# Altium schematic sheet DAU-3Phase-Measuring.SchDoc
size A3
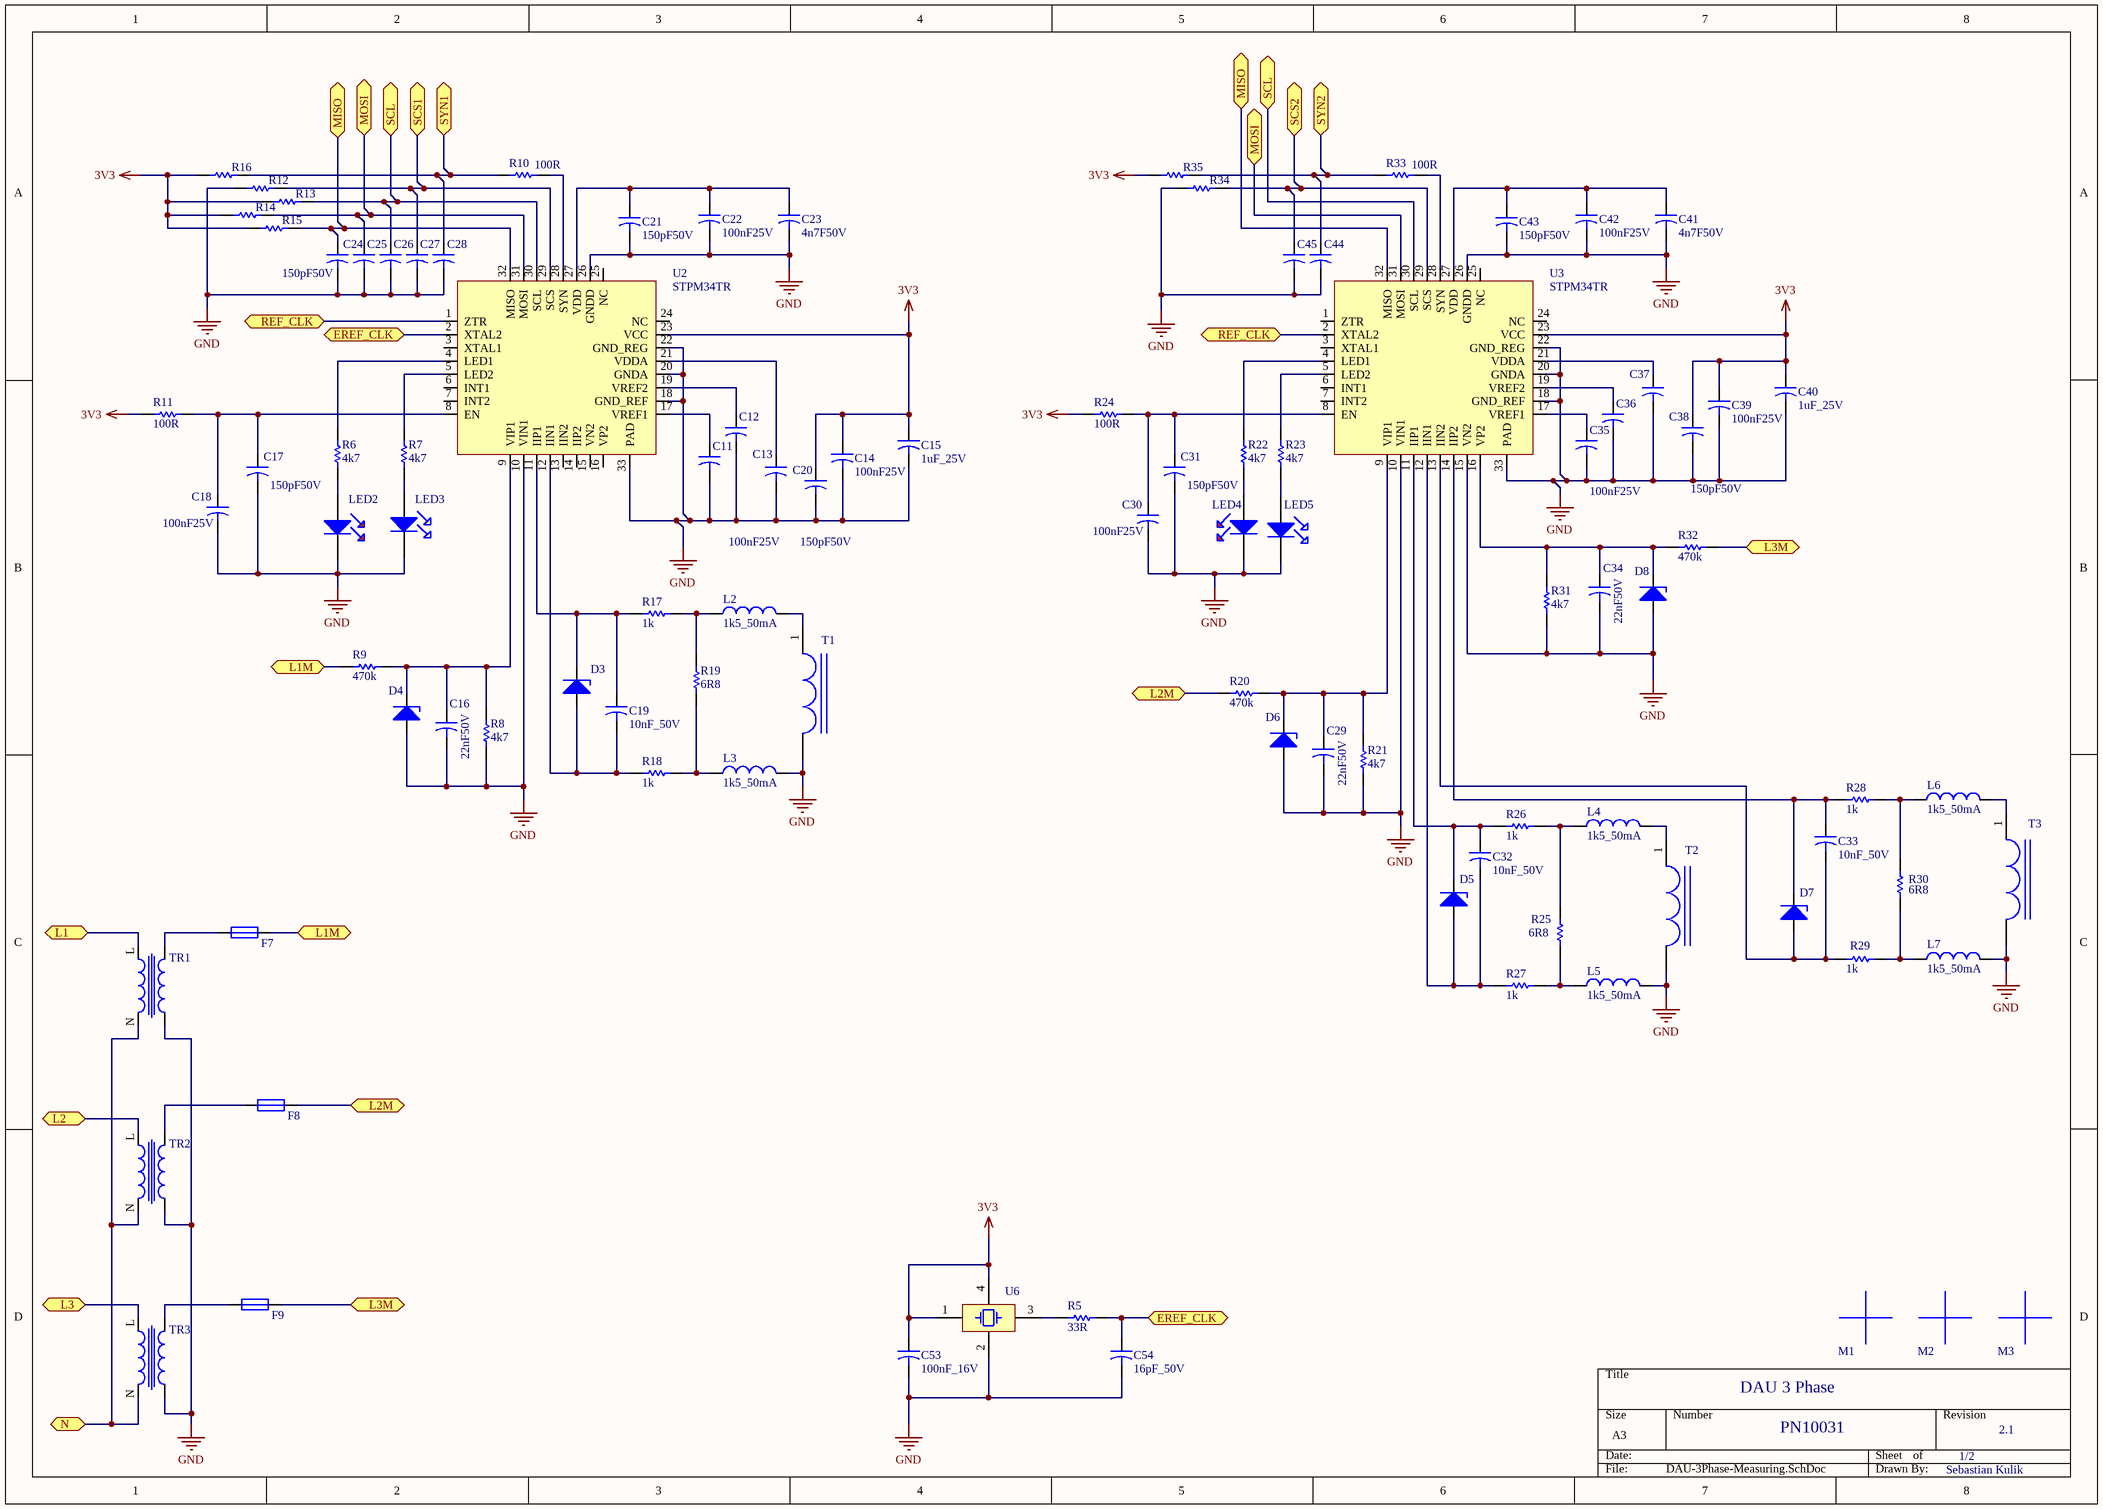
[diagram p0: DAU-3Phase-Measuring.SchDoc]

## Parts
C11  value 100nF25V  [C0402]  (hidden comment: 100nF25V_0402)
C12  100nF25V_0402  [C0402]  (value not drawn)
C13  100nF25V_0402  [C0402]  (value not drawn)
C14  value 100nF25V  [C0402]  (hidden comment: 100nF25V_0402)
C15  value 1uF_25V  [C0603]  (hidden comment: 1uF25V_0603)
C16  value 22nF50V  [C0603]  (hidden comment: 22nF50V_0603)
C17  value 150pF50V  [C0402]  (hidden comment: 150p50V_0402)
C18  value 100nF25V  [C0402]  (hidden comment: 100nF25V_0402)
C19  value 10nF_50V  [C0603]  (hidden comment: 10nF50V_0603)
C20  value 150pF50V  [C0402]  (hidden comment: 150p50V_0402)
C21  value 150pF50V  [C0402]  (hidden comment: 150p50V_0402)
C22  value 100nF25V  [C0402]  (hidden comment: 100nF25V_0402)
C23  value 4n7F50V  [C0402]  (hidden comment: 4n7F50V_0402)
C24  value 150pF50V  [C0402]  (hidden comment: 150p50V_0402)
C25  150p50V_0402  [C0402]  (value not drawn)
C26  150p50V_0402  [C0402]  (value not drawn)
C27  150p50V_0402  [C0402]  (value not drawn)
C28  150p50V_0402  [C0402]  (value not drawn)
C29  value 22nF50V  [C0603]  (hidden comment: 22nF50V_0603)
C30  value 100nF25V  [C0402]  (hidden comment: 100nF25V_0402)
C31  value 150pF50V  [C0402]  (hidden comment: 150p50V_0402)
C32  value 10nF_50V  [C0603]  (hidden comment: 10nF50V_0603)
C33  value 10nF_50V  [C0603]  (hidden comment: 10nF50V_0603)
C34  value 22nF50V  [C0603]  (hidden comment: 22nF50V_0603)
C35  value 100nF25V  [C0402]  (hidden comment: 100nF25V_0402)
C36  100nF25V_0402  [C0402]  (value not drawn)
C37  100nF25V_0402  [C0402]  (value not drawn)
C38  value 150pF50V  [C0402]  (hidden comment: 150p50V_0402)
C39  value 100nF25V  [C0402]  (hidden comment: 100nF25V_0402)
C40  value 1uF_25V  [C0603]  (hidden comment: 1uF25V_0603)
C41  value 4n7F50V  [C0402]  (hidden comment: 4n7F50V_0402)
C42  value 100nF25V  [C0402]  (hidden comment: 100nF25V_0402)
C43  value 150pF50V  [C0402]  (hidden comment: 150p50V_0402)
C44  150p50V_0402  [C0402]  (value not drawn)
C45  150p50V_0402  [C0402]  (value not drawn)
C53  value 100nF_16V  [C0402]  (hidden comment: 100nF16V_0402)
C54  value 16pF_50V  [C0402]  (hidden comment: 16pF50V_0402)
D3  MMSZ4678T1G  [SOD123]  (value not drawn)
D4  MMSZ4678T1G  [SOD123]  (value not drawn)
D5  MMSZ4678T1G  [SOD123]  (value not drawn)
D6  MMSZ4678T1G  [SOD123]  (value not drawn)
D7  MMSZ4678T1G  [SOD123]  (value not drawn)
D8  MMSZ4678T1G  [SOD123]  (value not drawn)
F7  MCMET 250MA 250V  [TR5]  (value not drawn)
F8  MCMET 250MA 250V  [TR5]  (value not drawn)
F9  MCMET 250MA 250V  [TR5]  (value not drawn)
L2  value 1k5_50mA  [L0603]  (hidden comment: 1k5_50mA_0603)
L3  value 1k5_50mA  [L0603]  (hidden comment: 1k5_50mA_0603)
L4  value 1k5_50mA  [L0603]  (hidden comment: 1k5_50mA_0603)
L5  value 1k5_50mA  [L0603]  (hidden comment: 1k5_50mA_0603)
L6  value 1k5_50mA  [L0603]  (hidden comment: 1k5_50mA_0603)
L7  value 1k5_50mA  [L0603]  (hidden comment: 1k5_50mA_0603)
LED2  WL-SMCW-RED  [WE-0603]  (value not drawn)
LED3  WL-SMCW-YELLOW  [WE-0603]  (value not drawn)
LED4  WL-SMCW-RED  [WE-0603]  (value not drawn)
LED5  WL-SMCW-YELLOW  [WE-0603]  (value not drawn)
M1  Paste Mark  [Mark-3mm]  (value not drawn)
M2  Paste Mark  [Mark-3mm]  (value not drawn)
M3  Paste Mark  [Mark-3mm]  (value not drawn)
R5  value 33R  [R0402]  (hidden comment: 33R_0402)
R6  value 4k7  [R0402]  (hidden comment: 4k7_0402)
R7  value 4k7  [R0402]  (hidden comment: 4k7_0402)
R8  value 4k7  [R0204-MELF4]  (hidden comment: 4k7_0204_MELF)
R9  value 470k  [R0204-MELF4]  (hidden comment: 470k_0204_MELF)
R10  value 100R  [R0402]  (hidden comment: 100R_0402)
R11  value 100R  [R0402]  (hidden comment: 100R_0402)
R12  10k_0402  [R0402]  (value not drawn)
R13  10k_0402  [R0402]  (value not drawn)
R14  10k_0402  [R0402]  (value not drawn)
R15  10k_0402  [R0402]  (value not drawn)
R16  10k_0402  [R0402]  (value not drawn)
R17  value 1k  [R0603(1608)]  (hidden comment: 1k_0603)
R18  value 1k  [R0603(1608)]  (hidden comment: 1k_0603)
R19  value 6R8  [R0204-MELF4]  (hidden comment: 6R8_0204_MELF)
R20  value 470k  [R0204-MELF4]  (hidden comment: 470k_0204_MELF)
R21  value 4k7  [R0204-MELF4]  (hidden comment: 4k7_0204_MELF)
R22  value 4k7  [R0402]  (hidden comment: 4k7_0402)
R23  value 4k7  [R0402]  (hidden comment: 4k7_0402)
R24  value 100R  [R0402]  (hidden comment: 100R_0402)
R25  value 6R8  [R0204-MELF4]  (hidden comment: 6R8_0204_MELF)
R26  value 1k  [R0603(1608)]  (hidden comment: 1k_0603)
R27  value 1k  [R0603(1608)]  (hidden comment: 1k_0603)
R28  value 1k  [R0603(1608)]  (hidden comment: 1k_0603)
R29  value 1k  [R0603(1608)]  (hidden comment: 1k_0603)
R30  value 6R8  [R0204-MELF4]  (hidden comment: 6R8_0204_MELF)
R31  value 4k7  [R0204-MELF4]  (hidden comment: 4k7_0204_MELF)
R32  value 470k  [R0204-MELF4]  (hidden comment: 470k_0204_MELF)
R33  value 100R  [R0402]  (hidden comment: 100R_0402)
R34  10k_0402  [R0402]  (value not drawn)
R35  10k_0402  [R0402]  (value not drawn)
T1  AC1020  [AC1010]  (value not drawn)
T2  AC1020  [AC1010]  (value not drawn)
T3  AC1020  [AC1010]  (value not drawn)
TR1  BV 202 0157  [TRAFO_0,35VA]  (value not drawn)
TR2  BV 202 0157  [TRAFO_0,35VA]  (value not drawn)
TR3  BV 202 0157  [TRAFO_0,35VA]  (value not drawn)
U2  STPM34TR  [QFN32_L-Vias]
U3  STPM34TR  [QFN32_L-Vias]
U6  SG - 211 S*E -16.000M  [SG - 211 S*E]  (value not drawn)

## Ports
EREF_CLK, L1, L1M, L2, L2M, L3, L3M, MISO, MOSI, N, REF_CLK, SCL, SCS1, SCS2, SYN1, SYN2

## Nets
3V3: C14.1 C15.1 C20.1 C38.1 C39.1 C40.1 C53.1 R11.1 R13.1 R14.1 R15.1 R16.1 R24.1 R35.1 U2.23(VCC) U3.23(VCC) U6.1(E/D) U6.4(VCC)
GND: C11.2 C12.2 C13.2 C14.2 C15.2 C16.2 C17.2 C18.2 C20.2 C21.2 C22.2 C23.2 C24.2 C25.2 C26.2 C27.2 C28.2 C29.2 C30.2 C31.2 C34.2 C35.2 C36.2 C37.2 C38.2 C39.2 C40.2 C41.2 C42.2 C43.2 C44.2 C45.2 C53.2 C54.2 D4.2(A) D6.2(A) D8.2(A) L3.2 L5.2 L7.2 LED2.1(K) LED3.1(K) LED4.1(K) LED5.1(K) R8.1 R12.1 R21.1 R31.1 R34.1 T1.2 T2.2 T3.2 TR1.OUT2 TR2.OUT2 TR3.OUT2 U2.10(VIN1) U2.18(GND_REF) U2.20(GNDA) U2.22(GND_REG) U2.26(GNDD) U2.33(PAD) U3.10(VIN1) U3.15(VN2) U3.18(GND_REF) U3.20(GNDA) U3.22(GND_REG) U3.26(GNDD) U3.33(PAD) U6.2(GND)
EREF_CLK: C54.1 R5.2 U2.2(XTAL2) ; port EREF_CLK
L1: TR1.L ; port L1
L1M: F7.2 R9.1 ; port L1M
L2: TR2.L ; port L2
L2M: F8.2 R20.1 ; port L2M
L3: TR3.L ; port L3
L3M: F9.2 R32.1 ; port L3M
MISO: C24.1 R15.2 U2.32(MISO) U3.32(MISO) ; port MISO
MOSI: C25.1 R14.2 U2.31(MOSI) U3.31(MOSI) ; port MOSI
N: TR1.N TR2.N TR3.N ; port N
REF_CLK: U2.1(ZTR) U3.2(XTAL2) ; port REF_CLK
SCL: C26.1 R13.2 U2.30(SCL) U3.30(SCL) ; port SCL
SCS1: C27.1 R12.2 U2.29(SCS) ; port SCS1
SCS2: C45.1 R34.2 U3.29(SCS) ; port SCS2
SYN1: C28.1 R10.2 R16.2 ; port SYN1
SYN2: C44.1 R33.2 R35.2 ; port SYN2
NetC11_1: C11.1 U2.17(VREF1)
NetC12_1: C12.1 U2.19(VREF2)
NetC13_1: C13.1 U2.21(VDDA)
NetC16_1: C16.1 D4.1(K) R8.2 R9.2 U2.9(VIP1)
NetC17_1: C17.1 C18.1 R11.2 U2.8(EN)
NetC19_1: C19.1 D3.1(K) R17.1 U2.11(IIP1)
NetC19_2: C19.2 D3.2(A) R18.1 U2.12(IIN1)
NetC21_1: C21.1 C22.1 C23.1 U2.27(VDD)
NetC29_1: C29.1 D6.1(K) R20.2 R21.2 U3.9(VIP1)
NetC30_1: C30.1 C31.1 R24.2 U3.8(EN)
NetC32_1: C32.1 D5.1(K) R26.1 U3.11(IIP1)
NetC32_2: C32.2 D5.2(A) R27.1 U3.12(IIN1)
NetC33_1: C33.1 D7.1(K) R28.1 U3.14(IIP2)
NetC33_2: C33.2 D7.2(A) R29.1 U3.13(IIN2)
NetC34_1: C34.1 D8.1(K) R31.2 R32.2 U3.16(VP2)
NetC35_1: C35.1 U3.17(VREF1)
NetC36_1: C36.1 U3.19(VREF2)
NetC37_1: C37.1 U3.21(VDDA)
NetC41_1: C41.1 C42.1 C43.1 U3.27(VDD)
NetF7_1: F7.1 TR1.OUT1
NetF8_1: F8.1 TR2.OUT1
NetF9_1: F9.1 TR3.OUT1
NetL2_1: L2.1 R17.2 R19.2
NetL2_2: L2.2 T1.1
NetL3_1: L3.1 R18.2 R19.1
NetL4_1: L4.1 R25.2 R26.2
NetL4_2: L4.2 T2.1
NetL5_1: L5.1 R25.1 R27.2
NetL6_1: L6.1 R28.2 R30.2
NetL6_2: L6.2 T3.1
NetL7_1: L7.1 R29.2 R30.1
NetLED2_2: LED2.2(A) R6.1
NetLED3_2: LED3.2(A) R7.1
NetLED4_2: LED4.2(A) R22.1
NetLED5_2: LED5.2(A) R23.1
NetR5_1: R5.1 U6.3(OSC2)
NetR6_2: R6.2 U2.4(LED1)
NetR7_2: R7.2 U2.5(LED2)
NetR10_1: R10.1 U2.28(SYN)
NetR22_2: R22.2 U3.4(LED1)
NetR23_2: R23.2 U3.5(LED2)
NetR33_1: R33.1 U3.28(SYN)

Not connected (* = marked no-connect by the designer): U2 3(XTAL1) 6(INT1) 7(INT2) 13(IIN2) 14(IIP2) 15(VN2) 16(VP2) 24(NC) 25(NC); U3 1(ZTR) 3(XTAL1) 6(INT1) 7(INT2) 24(NC) 25(NC)

## Notes on the sheet
- DAU 3 Phase
- PN10031
- 1/2
- 2.1
- Sebastian Kulik

## Library data of the parts
C11-C14 C18 C22 C30 C35-C37 C39 C42 = 100nF25V_0402: AVX, X5R, 10%, 25V; Deliverer PartNr: 1833862; Manufacturer PartNr: 04023D104KAT2A; Deliverer: Farnell; TDE-PN: C0036; Published: 09.12.2014; Part Description: AVX, X5R, 10%, 25V; Publisher: Sebastian Kulik; PackageDescription: C0402; Manufacturer: AVX
  C12 C13 C36 C37: Value: 100nF25V
C15 C40 = 1uF25V_0603: MLCC series, X5R, 10%, 25V; Deliverer PartNr: 1658868RL; Manufacturer: AVX; Manufacturer PartNr: 06033D105KAT2A; Deliverer: Farnell; TDE-PN: C0006; Published: 13.02.2014; Part Description: MLCC series, X5R, 10%, 25V; Publisher: Sebastian Kulik; PackageDescription: C0603
C16 C29 C34 = 22nF50V_0603: AVX ,  X7R, 5%, 50V; Deliverer PartNr: 1835412; Manufacturer PartNr: 06035C223JAT2A; Deliverer: Farnell; TDE-PN: C0034; Published: 13.02.2014; Part Description: AVX ,  X7R, 5%, 50V; Publisher: Sebastian Kulik; PackageDescription: C0603; Manufacturer: AVX
C17 C20 C21 C24 C31 C38 C43 = 150p50V_0402: C series, 5%, 50V; Part Description: GRM series,5%, 50V; Deliverer PartNr: 8819602; Manufacturer: Murata; Manufacturer PartNr: GRM1555C1H151JA01D; Deliverer: Farnell; TDE-PN: C0059; Published: 11.12.2014; Publisher: Sebastian Kulik; PackageDescription: C0402
C19 C32 C33 = 10nF50V_0603: GRM series,  X7R, 10%, 50V; Deliverer PartNr: 2366904; Manufacturer: Murata; Manufacturer PartNr: GRM188R71H103KA01D; Deliverer: Farnell; TDE-PN: C0060; Published: 12.12.2014; Part Description: GRM series,  X7R, 10%, 50V; Publisher: Sebastian Kulik; PackageDescription: C0603
C23 C41 = 4n7F50V_0402: AVX, X7R, 10%, 50V; Deliverer PartNr: 2280797; Manufacturer PartNr: 04025C472KAT2A; Deliverer: Farnell; TDE-PN: C0001; Published: 11.02.2014; Part Description: AVX, X7R, 10%, 50V; Publisher: Sebastian Kulik; PackageDescription: C0402; Manufacturer: AVX
C25-C28 C44 C45 = 150p50V_0402: C series, 5%, 50V; Part Description: GRM series,5%, 50V; Deliverer PartNr: 8819602; Manufacturer: Murata; Manufacturer PartNr: GRM1555C1H151JA01D; Deliverer: Farnell; TDE-PN: C0059; Value: 150pF50V; Published: 11.12.2014; Publisher: Sebastian Kulik; PackageDescription: C0402
C53 = 100nF16V_0402: TDK. CGA series, X7R, 10%, 16V; Deliverer PartNr: 2366533; Manufacturer: TDK; Manufacturer PartNr: CGA2B1X7R1C104K050BC; Deliverer: Farnell; TDE-PN: C0025; Published: 12.02.2014; Part Description: TDK. CGA series, X7R, 10%, 16V; Publisher: Sebastian Kulik; PackageDescription: C0402
C54 = 16pF50V_0402: C series, 5%, 50V; Deliverer PartNr: 1865423; Manufacturer: Kemet; Manufacturer PartNr: C0402C160J5GACTU; Deliverer: Farnell; TDE-PN: C0020; Published: 11.03.2014; Part Description: C series, 5%, 50V; Publisher: Sebastian Kulik; PackageDescription: C0402
D3-D8 = MMSZ4678T1G: Z-Diode, 1.8V,  0.5W; Deliverer PartNr: 1459115; Manufacturer: ON Semi; TDE-PN: DIS0034; Deliverer: Farnell; Published: 29.04.2014; Publisher: Sebastian Kulik; PackageDescription: SOD-123; Manufacturer PartNr: MMSZ4678T1G
F7-F9 = MCMET 250MA 250V: Deliverer PartNr: 1566065; Manufacturer: Multicomp; Deliverer: Farnell; TDFE-PN: M0008; Published: 05.11.2014; Publisher: Sebastian Kulik; PackageDescription: TR-5; Manufacturer PartNr: MCMET 250MA 250V; Value: MCMET 250MA 250V
L2-L7 = 1k5_50mA_0603: WE, Ferrit, 1k5_50mA_0603; Deliverer PartNr: 742792691; TDE-PN: P0028; Deliverer: WE; Manufacturer: WE; Manufacturer PartNr: 742792691; Published: 11.12.2014; Publisher: Sebastian Kulik; PackageDescription: L0603
LED2 LED4 = WL-SMCW-RED: LED, 0603, red; Manufacturer PartNr: 150060RS75000; TDE-PN: DIS0023; Deliverer: WE; Published: 24.05.2014; Publisher: Sebastian Kulik; PackageDescription: WE-0603; Deliverer PartNr: 150060RS75000; Manufacturer: WE
LED3 LED5 = WL-SMCW-YELLOW: LED, 0603, yellow; Manufacturer PartNr: 150060YS75000; TDE-PN: DIS0025; Deliverer: WE; Published: 24.05.2014; Publisher: Sebastian Kulik; PackageDescription: WE-0603; Deliverer PartNr: 150060YS75000; Manufacturer: WE
M1-M3 = Mark: Comment_1: PasteMark
R5 = 33R_0402: Vishay CRCW series, 63mW, 1%; Manufacturer PartNr: CRCW040233R0FKEAHP; Deliverer PartNr: 1738830; TDE-PN: R0037; Deliverer: Farnell; Published: 12.02.2014; Publisher: Sebastian Kulik; PackageDescription: 0402; Manufacturer: Vishay; Part Description: Vishay CRCW series, 63mW, 1%
R6 R7 R22 R23 = 4k7_0402: Vishay CRCW series, 63mW, 1%; Manufacturer PartNr: CRCW04024K70FKED; Deliverer PartNr: 2121688; TDE-PN: R0009; Deliverer: Farnell; Published: 25.02.2014; Publisher: Sebastian Kulik; PackageDescription: 0402; Manufacturer: Vishay; Part Description: Vishay CRCW series, 63mW, 1%
R8 R21 R31 = 4k7_0204_MELF: MMA series, 1%, 250mW; Manufacturer: Vishay; Manufacturer PartNr: MMA02040E4701BB100; Deliverer PartNr: 3086100; TDE-PN: R0073; Deliverer: Farnell; Published: 23.02.2015; Publisher: Sebastian Kulik; PackageDescription: R0204-MELF4; Part Description: MMA series, 1%, 250mW
R9 R20 R32 = 470k_0204_MELF: MMA series, 1%, 250mW; Manufacturer: Vishay; Manufacturer PartNr: MMA02040C4703FB300; Deliverer PartNr: 3088108; TDE-PN: R0074; Deliverer: Farnell; Published: 23.02.2015; Publisher: Sebastian Kulik; PackageDescription: R0204-MELF4; Part Description: MMA series, 1%, 250mW
R10 R11 R24 R33 = 100R_0402: CRCW series, 125mW, 1%; Manufacturer: Vishay; Manufacturer PartNr: CRCW0402100RFKEAHP; Deliverer PartNr: 1738837RL; TDE-PN: R0026; Deliverer: Farnell; Published: 07.04.2014; Publisher: Sebastian Kulik; PackageDescription: 0402; Part Description: CRCW series, 125mW, 1%
R12-R16 R34 R35 = 10k_0402: Vishay CRCW series, 125mW, 1%; Manufacturer PartNr: CRCW040210K0FKEAHP; Deliverer PartNr: 1738864; TDE-PN: R0012; Deliverer: Farnell; Value: 10k; Published: 12.02.2014; Publisher: Sebastian Kulik; PackageDescription: 0402; Manufacturer: Vishay; Part Description: Vishay CRCW series, 125mW, 1%
R17 R18 R26-R29 = 1k_0603: Vishay CRCW series, 100mW, 1%; Manufacturer PartNr: CRCW06031K00FKTA; Deliverer PartNr: 1652848; TDE-PN: R0070; Deliverer: Farnell; Published: 03.04.2014; Publisher: Sebastian Kulik; PackageDescription: 0603; Manufacturer: Vishay; Part Description: Vishay CRCW series, 100mW, 1%
R19 R25 R30 = 6R8_0204_MELF: MMA series, 1%, 250mW; Manufacturer: Vishay; Manufacturer PartNr: MMA02040C6808FB300; Deliverer PartNr: 3087529; TDE-PN: R0071; Deliverer: Farnell; Published: 12.12.2014; Publisher: Sebastian Kulik; PackageDescription: R0204-MELF4; Part Description: MMA series, 1%, 250mW
T1-T3 = AC1020: Current transformer; Manufacturer PartNr: AC-1020; Deliverer PartNr: 1707839; Manufacturer: Acme Electric; TDE-PN: DIS0028; Deliverer: Farnell; Published: 28.10.2014; Publisher: Sebastian Kulik; PackageDescription: AC1010
TR1-TR3 = BV 202 0157: WE-PD2, 10uH2A; Deliverer PartNr: 1636035; Manufacturer: Hahn; Deliverer: Farnell; TDE-PN: P0024; Manufacturer PartNr: BV 202 0157; Published: 05.11.2014; Publisher: Sebastian Kulik; PackageDescription: TRAFO_0,35VA; Value: BV 202 0157
U2 U3 = STPM34TR: 2 phase voltage/current measuring device; Manufacturer: STMicro; Deliverer: EBV; TDE-PN: IC0064; Published: 10.12.2014; Deliverer PartNr: STPM34TR; PackageDescription: QFN32L; Publisher: Sebastian Kulik; Manufacturer PartNr: STPM34TR
U6 = SG - 211 S*E -16.000M: Crystal; Deliverer PartNr: 2405755; Manufacturer PartNr: X1G0036210032; Manufacturer: Epson; Deliverer: Farnell; TDE-PN: IC0061; Published: 11.12.2014; PackageDescription: SG-221 S*E; Publisher: Sebastian Kulik